# EAGLE design module_SX1278_A (EAGLE 8.4.0)
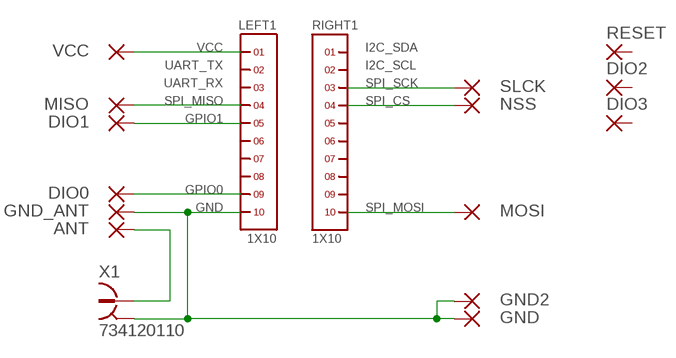
[diagram p0: schematic, sheet 1]

## Parts
ANT  SMD1  [SMD0,65-1,27]
DIO0  SMD1  [SMD0,65-1,27]
DIO1  SMD1  [SMD0,65-1,27]
DIO2  SMD1  [SMD0,65-1,27]
DIO3  SMD1  [SMD0,65-1,27]
GND  SMD1  [SMD0,65-1,27]
GND2  SMD1  [SMD0,65-1,27]
GND_ANT  SMD1  [SMD0,65-1,27]
LEFT1  1X10  [1X10]
MISO  SMD1  [SMD0,65-1,27]
MOSI  SMD1  [SMD0,65-1,27]
NSS  SMD1  [SMD0,65-1,27]
RESET  SMD1  [SMD0,65-1,27]
RIGHT1  1X10  [1X10]
SLCK  SMD1  [SMD0,65-1,27]
VCC  SMD1  [SMD0,65-1,27]
X1  734120110  [734120110]

## Nets
ANT: ANT.1(P) X1.1
GND: GND2.1(P) GND.1(P) GND_ANT.1(P) LEFT1.10 X1.S@1 X1.S@2 X1.S@3
INT0: DIO0.1(P) LEFT1.9
INT1: DIO1.1(P) LEFT1.5
SPI_CS: NSS.1(P) RIGHT1.4
SPI_MISO: LEFT1.4 MISO.1(P)
SPI_MOSI: MOSI.1(P) RIGHT1.10
SPI_SCK: RIGHT1.3 SLCK.1(P)
VCC: LEFT1.1 VCC.1(P)
Unconnected: DIO2.1(P) DIO3.1(P) LEFT1.2 LEFT1.3 LEFT1.6 LEFT1.7 LEFT1.8 RESET.1(P) RIGHT1.1 RIGHT1.2 RIGHT1.5 RIGHT1.6 RIGHT1.7 RIGHT1.8 RIGHT1.9

## Notes on the sheet
- VCC | I2C_SDA
- UART_TX | I2C_SCL
- UART_RX | SPI_SCK
- SPI_MISO | SPI_CS
- GPIO1
- GPIO0
- GND | SPI_MOSI

## Library data of the parts
ANT DIO0 DIO1-DIO3 GND GND2 GND_ANT MISO MOSI NSS RESET SLCK VCC = wirepad:SMD1: SMD PAD
LEFT1 RIGHT1 = headers(2mm):1X10
X1 = con-coax:734120110: MICRO COAXIAL CONNECTOR RECEPTACLE VERTICAL Source: Data sheet <http://www.molex.com/pdm_docs/sd/734120110_sd.pdf>

## Board
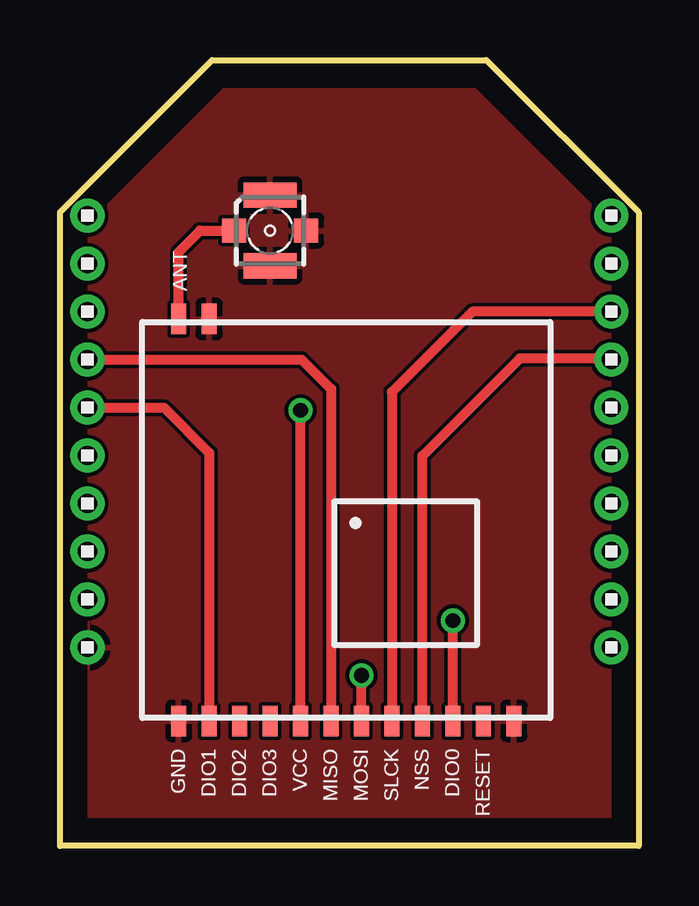
[diagram p1: board, top side]
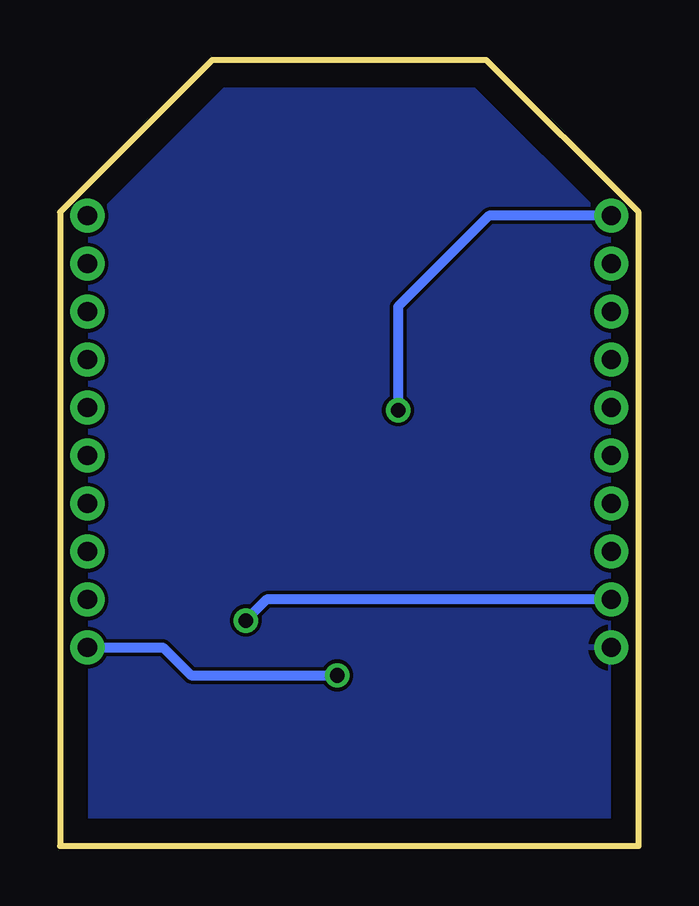
[diagram p2: board, bottom side, seen from below]

Size 24.13 x 32.77 mm. Coordinates in mm from the lower left corner, seen from the top.
Outline: 0,0 0,26.42 6.35,32.77 17.78,32.77 24.13,26.42 24.13,0 0,0
Copper layers (1*16): Top 0.035mm / dielectric 1.5mm / Bottom 0.035mm
Design rules "default": minimum track width 6mil, minimum drill 0.35mm, track to track 6mil, track to pad 6mil, pad to pad 6mil, via to via 6mil, smd to smd 6mil, copper to edge 40mil, drill to drill 6mil, minimum pad ring 10mil, minimum via ring 8mil, stop-mask expansion 4mil, vias tented up to drill 0mil, thermal gap 10mil

### Footprints (pad centres in the part's own frame; a part is rotated, then mirrored left to right if it is on the bottom)
SMD0,65-1,27 = smd 0.635 x 1.27: 1 0,0
1X10 = drill 0.8 pad 1.422: 1 -9,0; 2 -7,0; 3 -5,0; 4 -3,0; 5 -1,0; 6 1,0; 7 3,0; 8 5,0; 9 7,0; 10 9,0
734120110 = smd 1 x 1: 1 0,-1.5; S@1 0,1.5 | smd 1.05 x 2.2: S@2 -1.475,0; S@3 1.475,0

### Placement (x,y rotation side)
ANT  4.95,21.97 180 top
DIO0  16.38,5.21 180 top
DIO1  6.22,5.21 180 top
DIO2  7.49,5.21 180 top
DIO3  8.76,5.21 180 top
GND  4.95,5.21 180 top
GND2  18.92,5.21 180 top
GND_ANT  6.22,21.97 180 top
LEFT1  1.14,17.27 270 top
MISO  11.3,5.21 180 top
MOSI  12.57,5.21 180 top
NSS  15.11,5.21 180 top
RESET  17.65,5.21 180 top
RIGHT1  22.99,17.27 270 top
SLCK  13.84,5.21 180 top
VCC  10.03,5.21 180 top
X1  8.76,25.65 270 top

### Tracks (layer width: path | path; a pad name or v marks a point on that pad's centre or on a via)
ANT
  Top 0.406: ANT.1 4.95,24.77 5.84,25.65 X1.1
GND
  pour Bottom: -0.51,-0.51 -0.51,26.67 6.1,33.27 18.03,33.27 24.64,26.67 24.64,-0.51
  pour Top: -0.25,-0.25 -0.25,26.54 6.22,33.02 17.91,33.02 24.38,26.54 24.38,-0.25
INT0  (via drill 0.61)
  Top 0.406: DIO0.1 v16.38,9.4
  Bottom 0.406: LEFT1.9 15.51,10.27 v16.38,9.4
INT1
  Top 0.406: DIO1.1 6.22,16.38 4.33,18.27 LEFT1.5
SPI_CS
  Top 0.406: NSS.1 15.11,16.26 19.18,20.32 22.78,20.32 22.83,20.27 RIGHT1.4
SPI_MISO
  Top 0.406: MISO.1 11.3,19.05 10.08,20.27 LEFT1.4
SPI_MOSI  (via drill 0.61)
  Top 0.406: MOSI.1 v12.57,7.11
  Bottom 0.406: v12.57,7.11 18.67,7.11 19.83,8.27 RIGHT1.10
SPI_SCK
  Top 0.406: RIGHT1.3 17.19,22.27 13.84,18.92 SLCK.1
VCC  (via drill 0.61)
  Top 0.406: VCC.1 v10.03,18.16
  Bottom 0.406: v10.03,18.16 10.03,22.48 6.24,26.27 LEFT1.1

### Text on the board
_tNames: ANT | GND | DIO1 | DIO2 | DIO3 | VCC | MISO | MOSI | SLCK | NSS | DIO0 | RESET
HeatSink: PWR: / LOG: | 3.3 V / 3.3 V | GND | SX1278 | GND